# EAGLE design board (EAGLE 8.3.2)
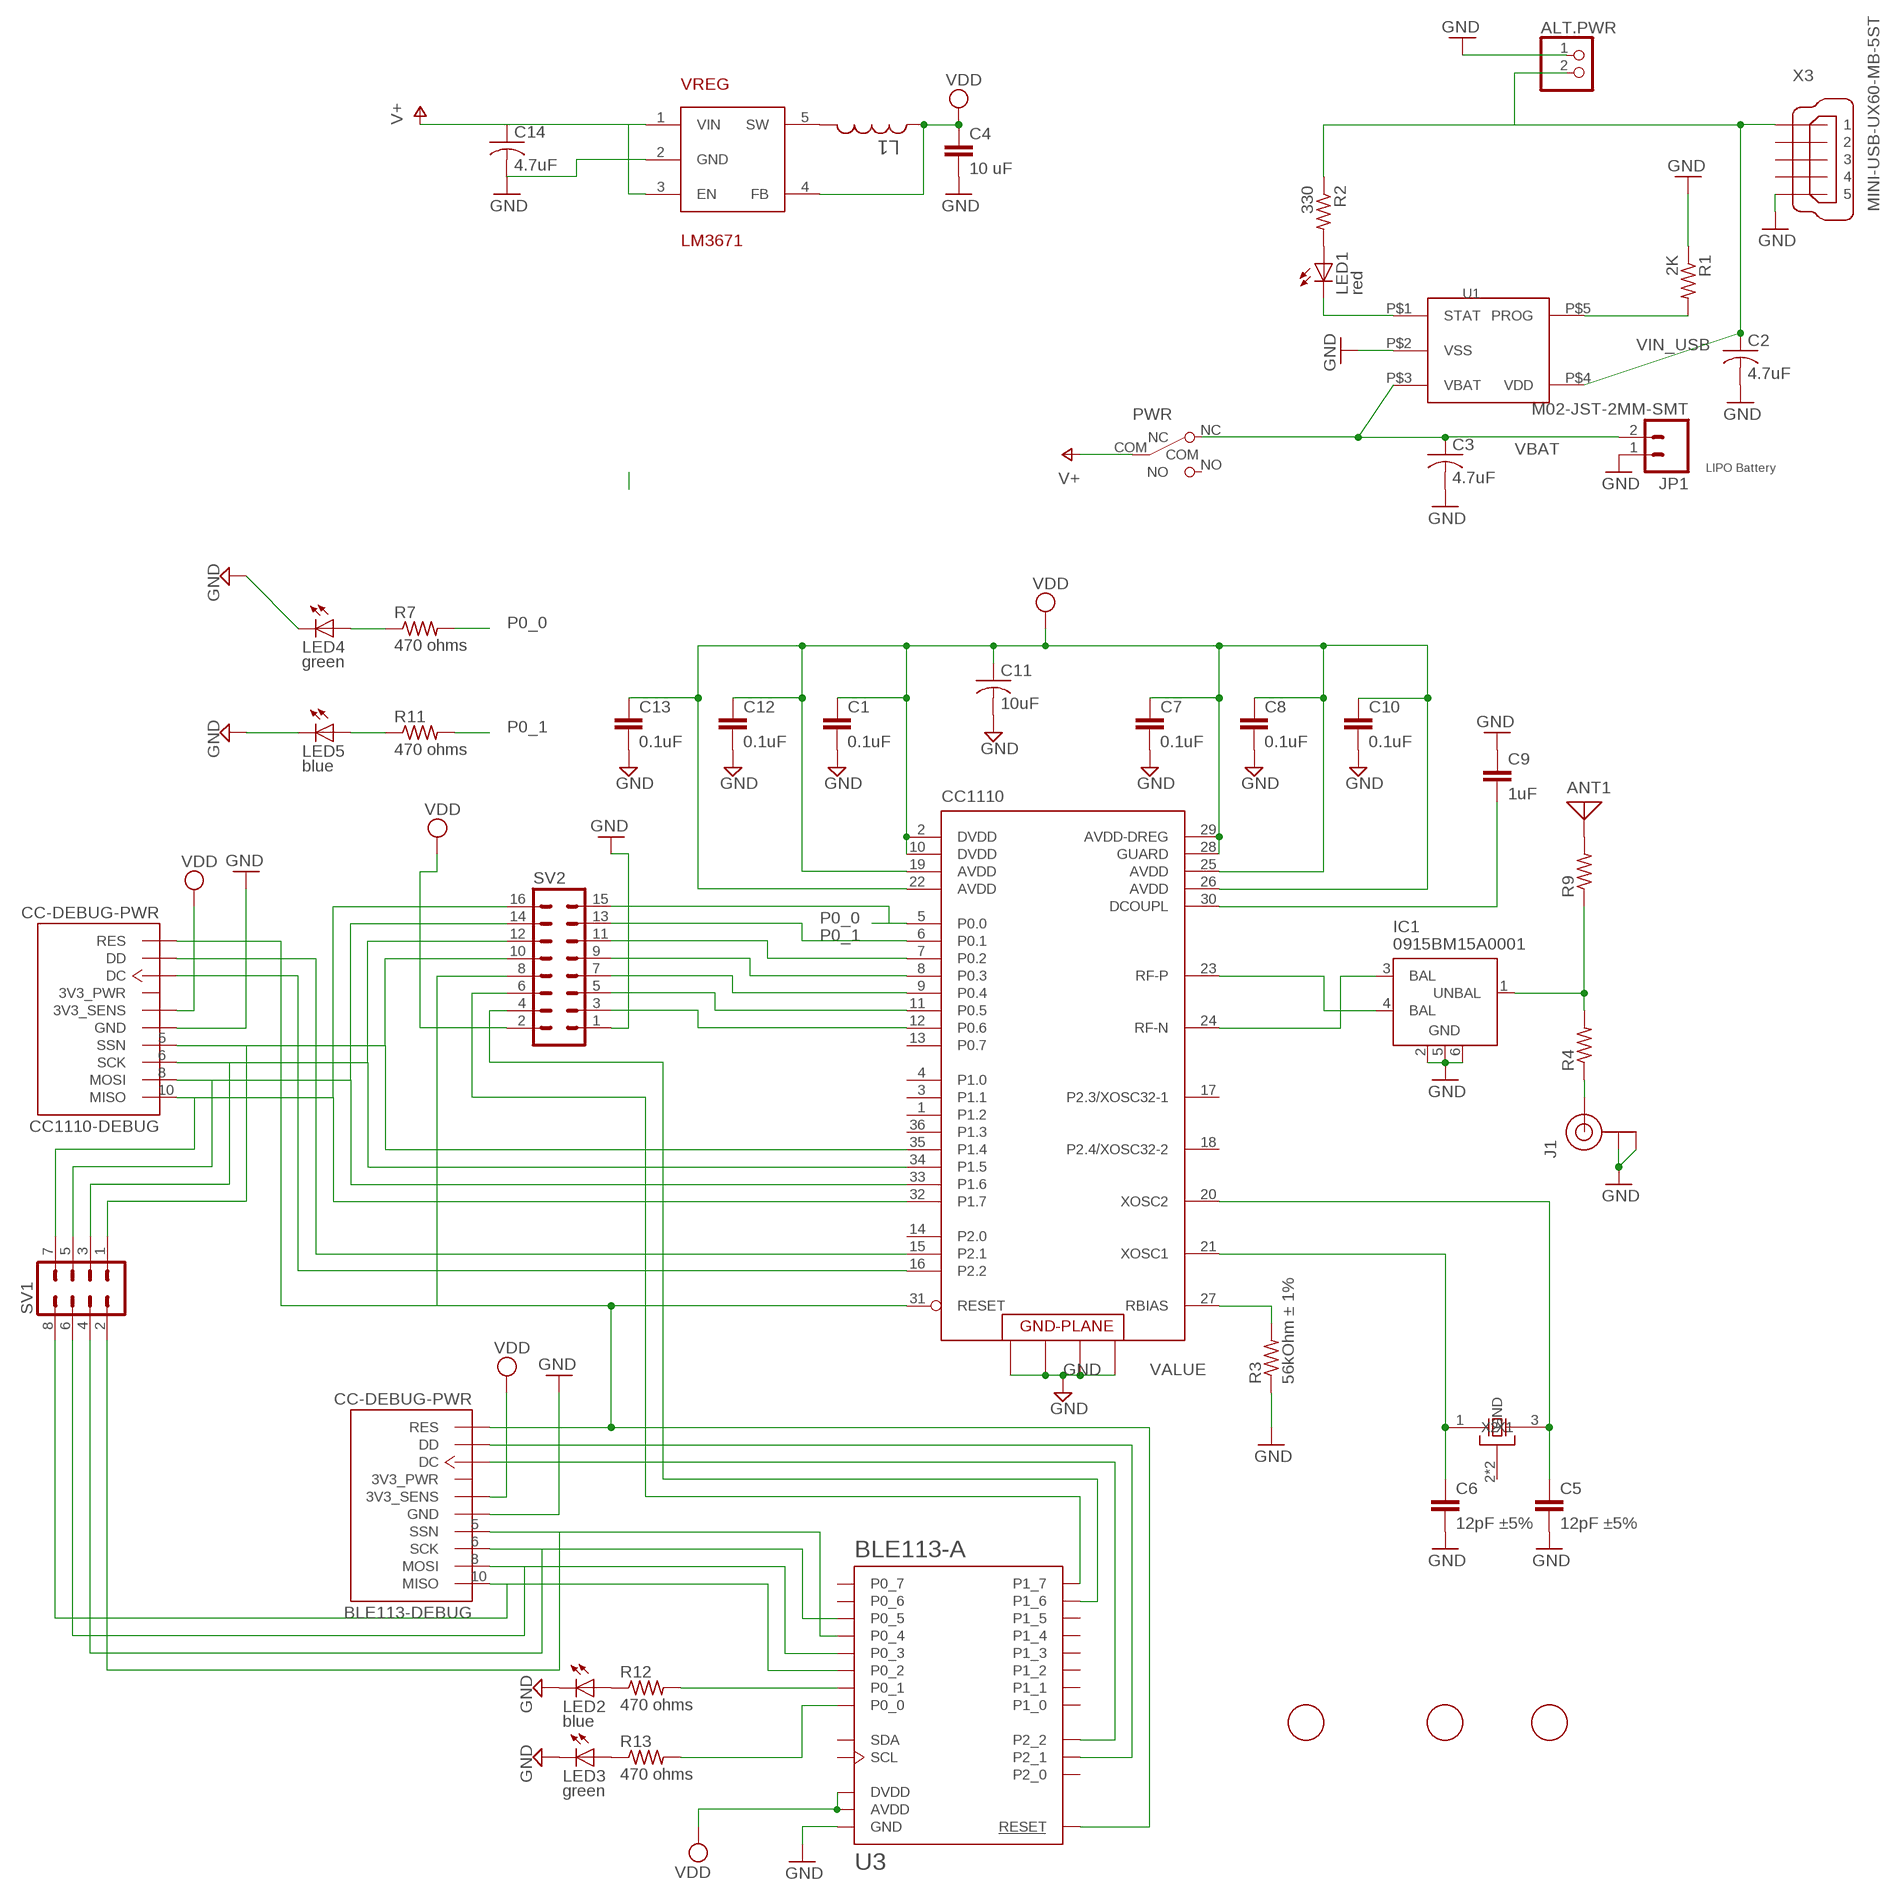
[diagram p0: schematic, sheet 1]

## Parts
ALT.PWR  PINHD-1X2  [1X02]
ANT1  ANTENNA  [PAD-01]
BLE113-DEBUG  CC-DEBUG-PWR  [CC-P05]
C1  0.1uF  C-EUC0402  [C0402]
C2  4.7uF  C-USC0603K  [C0603K]
C3  4.7uF  C-USC0603K  [C0603K]
C4  10 uF  C-EUC0805K  [C0805K]
C5  12pF ±5%  C-EUC0402K  [C0402K]
C6  12pF ±5%  C-EUC0402K  [C0402K]
C7  0.1uF  C-EUC0402  [C0402]
C8  0.1uF  C-EUC0402  [C0402]
C9  1uF  C-EUC0402K  [C0402K]
C10  0.1uF  C-EUC0402  [C0402]
C11  10uF  C-USC0805K  [C0805K]
C12  0.1uF  C-EUC0402  [C0402]
C13  0.1uF  C-EUC0402  [C0402]
C14  4.7uF  C-USC0603K  [C0603K]
CC1110  CC1110  [QLP-36_UPDATE]
CC1110-DEBUG  CC-DEBUG-PWR  [CC-P05]
FID1  FIDUCIAL  [FIDUCIAL_1MM]
FID2  FIDUCIAL  [FIDUCIAL_1MM]
FID3  FIDUCIAL  [FIDUCIAL_1MM]
IC1  0915BM15A0001  [0915BM15A0001]
J1  U.FL  [U.FL]
JP1  M02-JST-2MM-SMT  [JST-2-SMD]
L1  2.2 uH  L-USL2825P  [L2825P]
LED1  red  LEDSML0603  [SML0603]
LED2  blue  LEDSML0603  [SML0603]
LED3  green  LEDSML0603  [SML0603]
LED4  green  LEDSML0603  [SML0603]
LED5  blue  LEDSML0603  [SML0603]
PWR  SW_SLIDE  [SLIDE_SWITCH_SMD]
R1  2K  R-US_R0402  [R0402]
R2  330  R-US_R0402  [R0402]
R3  56kOhm ± 1%  R-US_R0402  [R0402]
R4  R-US_R0402  [R0402]
R7  470 ohms  R-US_R0402  [R0402]
R9  R-US_R0402  [R0402]
R11  470 ohms  R-US_R0402  [R0402]
R12  470 ohms  R-US_R0402  [R0402]
R13  470 ohms  R-US_R0402  [R0402]
SV1  MA04-2  [MA04-2]
SV2  MA08-2  [MA08-2]
U1  MCP73831  [5PIN_SOT23]
U3  BLE113-A  [BLE113-A]
VREG  LM3671  [SOT23-5]
X1  24MHz 8pF 10ppm -20C +70C  CTS_32X25_SMD  [CTS_32X25]
X3  MINI-USB-UX60-MB-5ST  [UX60-MB-5ST]

## Nets
DC: CC1110-DEBUG.3(DC) CC1110.16(P2.2)
DC_BLE: BLE113-DEBUG.3(DC) U3.P2_2
DD: CC1110-DEBUG.4(DD) CC1110.15(P2.1)
DD_BLE: BLE113-DEBUG.4(DD) U3.P2_1
GND: ALT.PWR.1 BLE113-DEBUG.1(GND) C1.2 C2.2 C3.2 C4.2 C5.2 C6.2 C7.2 C8.2 C9.1 C10.2 C11.2 C12.2 C13.2 C14.2 CC1110-DEBUG.1(GND) CC1110.37(GND) CC1110.38(GND) CC1110.39(GND) CC1110.40(GND) IC1.2(GND) IC1.5(GND) IC1.6(GND) J1.P$1(GND) J1.P$2(GND) JP1.1 LED2.C LED3.C LED4.C LED5.C R1.1 R3.1 SV2.1 U1.P$2(VSS) U3.GND U3.GND@2(GND) U3.GND@3(GND) U3.GND@4(GND) U3.GND@5(GND) U3.GND@6(GND) U3.GND@7(GND) U3.GND@8(GND) U3.GND@9(GND) U3.GND@10(GND) VREG.2(GND) X3.5
MISO: CC1110-DEBUG.10(MISO) CC1110.32(P1.7) SV1.7 SV2.16
MISO_BLE: BLE113-DEBUG.10(MISO) SV1.8 U3.P0_2
MOSI: CC1110-DEBUG.8(MOSI) CC1110.33(P1.6) SV1.5 SV2.14
MOSI_BLE: BLE113-DEBUG.8(MOSI) SV1.6 U3.P0_3
N$2: LED1.C U1.P$1(STAT)
N$3: R1.2 U1.P$5(PROG)
N$4: LED1.A R2.2
N$5: CC1110.24(RF-N) IC1.3(BAL)
N$7: CC1110.23(RF-P) IC1.4(BAL)
N$9: J1.P$3(SIGNAL) R4.1
N$10: IC1.1(UNBAL) R4.2 R9.1
N$12: ANT1.1 R9.2
N$14: CC1110.27(RBIAS) R3.2
N$16: L1.2 VREG.5(SW)
N$18: C9.2 CC1110.30(DCOUPL)
N$20: C6.1 CC1110.21(XOSC1) X1.1(X1)
N$21: C5.1 CC1110.20(XOSC2) X1.3(X2)
N$24: LED4.A R7.1
N$25: LED5.A R11.1
N$29: LED2.A R12.1
N$30: LED3.A R13.1
N$31: R12.2 U3.P0_1
N$32: R13.2 U3.P0_0
P0.2: CC1110.7(P0.2) SV2.11
P0.3: CC1110.8(P0.3) SV2.9
P0.4: CC1110.9(P0.4) SV2.7
P0.5: CC1110.11(P0.5) SV2.5
P0.6: CC1110.12(P0.6) SV2.3
P0_0: CC1110.5(P0.0) R7.2 SV2.15
P0_1: CC1110.6(P0.1) R11.2 SV2.13
P1_6_BLE: SV2.4 U3.P1_6
P1_7_BLE: SV2.6 U3.P1_7
RESET: BLE113-DEBUG.7(RES) CC1110-DEBUG.7(RES) CC1110.31(RESET) SV2.8 U3.RESET
SCK: CC1110-DEBUG.6(SCK) CC1110.34(P1.5) SV1.3 SV2.12
SCK_BLE: BLE113-DEBUG.6(SCK) SV1.4 U3.P0_5
SSN: CC1110-DEBUG.5(SSN) CC1110.35(P1.4) SV1.1 SV2.10
SSN_BLE: BLE113-DEBUG.5(SSN) SV1.2 U3.P0_4
V+: C14.1 PWR.COM VREG.1(VIN) VREG.3(EN)
VBAT: C3.1 JP1.2 PWR.NC U1.P$3(VBAT)
VDD: BLE113-DEBUG.2(3V3_SENS) C1.1 C4.1 C7.1 C8.1 C10.1 C11.1 C12.1 C13.1 CC1110-DEBUG.2(3V3_SENS) CC1110.2(DVDD) CC1110.10(DVDD) CC1110.19(AVDD) CC1110.22(AVDD) CC1110.25(AVDD) CC1110.26(AVDD) CC1110.28(GUARD) CC1110.29(AVDD-DREG) L1.1 SV2.2 U3.AVDD U3.DVDD VREG.4(FB)
VIN_USB: ALT.PWR.2 C2.1 R2.1 U1.P$4(VDD) X3.1
Unconnected: BLE113-DEBUG.9(3V3_PWR) CC1110-DEBUG.9(3V3_PWR) CC1110.1(P1.2) CC1110.3(P1.1) CC1110.4(P1.0) CC1110.13(P0.7) CC1110.14(P2.0) CC1110.17(P2.3/XOSC32-1) CC1110.18(P2.4/XOSC32-2) CC1110.36(P1.3) PWR.NO U3.P0_6 U3.P0_7 U3.P1_0 U3.P1_1 U3.P1_2 U3.P1_3 U3.P1_4 U3.P1_5 U3.P2_0 U3.SCL U3.SDA X3.2 X3.3 X3.4

## Notes on the sheet
- LIPO Battery

## Power pins joined to a net without a drawn wire
GND: X1.2(GND) X1.4(GND)

## Library data of the parts
ALT.PWR = pinhead:PINHD-1X2: PIN HEADER
ANT1 = discrete:ANTENNA: Antenna
BLE113-DEBUG CC1110-DEBUG = parts:CC-DEBUG-PWR: CC debugger connection with various form factors. 2x5-pin 0.05" pitch header include Pin 9 (VDD) supply connection as separate pin. https://github.com/jrowberg/sf-oshw Last updated 2014-01-04 by Jeff Rowberg <jeff@rowberg.net>
C1 C4-C10 C12 C13 = rcl:C-EU: CAPACITOR
C2 C3 C11 C14 = rcl:C-US: CAPACITOR, American symbol
CC1110 = board:CC1110: True System-on-Chip with Low Power RF Transceiver and 8051 MCU
FID1-FID3 = adafruit:FIDUCIAL: For use by pick and place machines to calibrate the vision/machine, 1mm By microbuilder.eu
IC1 = parts:0915BM15A0001: 915 MHz Impedance Matched Balun-Filter For TI CC11xx Chipset family Data sheet <http://www.johansontechnology.com/datasheets/chipset-specific/0915BM15A0001.pdf>
J1 = SparkFun-Connectors:U.FL: SMD antenna connector- WRL-09144; PROD_ID: CONN-09193
JP1 = SparkFun-Connectors:M02: Standard 2-pin 0.1" header. Use with - straight break away headers ( PRT-00116) - right angle break away headers (PRT-00553) - swiss pins (PRT-00743) - machine pins (PRT-00117) - female headers (PRT-00115) Molex polarized connector foot print use with: PRT-08233 with associated crimp pins and housings. 2.54_SCREWTERM for use with PRT-10571. 3.5mm Screw Terminal footprints for PRT-08084 5mm Screw Terminal footprints for use with PRT-08432; PROD_ID: CONN-08352
L1 = rcl:L-US: INDUCTOR, American symbol
LED1-LED5 = led:LED: LED OSRAM: - CHIPLED LG R971, LG N971, LY N971, LG Q971, LY Q971, LO R971, LY R971 LH N974, LH R974 LS Q976, LO Q976, LY Q976 LO Q996 - Hyper CHIPLED LW Q18S LB Q993, LB Q99A, LB R99A - SideLED LS A670, LO A670, LY A670, LG A670, LP A670 LB A673, LV A673, LT A673, LW A673 LH A674 LY A675 LS A676, LA A676, LO A676, LY A676, LW A676 LS A679, LY A679, LG A679 - Hyper Micro SIDELED® LS Y876, LA Y876, LO Y876, LY Y876 LT Y87S - SmartLED LW L88C, LW L88S LB L89C, LB L89S, LG L890 LS L89K, LO L89K, LY L89K LS L896, LA L896, LO L896, LY L896 - TOPLED LS T670, LO T670, LY T670, LG T670, LP T670 LSG T670, LSP T670, LSY T670, LOP T670, LYG T670 LG T671, LOG T671, LSG T671 LB T673, LV T673, LT T673, LW T673 LH T674 LS T676, LA T676, LO T676, LY T676, LB T676, LH T676, LSB T676, LW T676 LB T67C, LV T67C, LT T67C, LS T67K, LO T67K, LY T67K, LW E67C LS E67B, LA E67B, LO E67B, LY E67B, LB E67C, LV E67C, LT E67C LW T67C LS T679, LY T679, LG T679 LS T770, LO T770, LY T770, LG T770, LP T770 LB T773, LV T773, LT T773, LW T773 LH T774 LS E675, LA E675, LY E675, LS T675 LS T776, LA T776, LO T776, LY T776, LB T776 LHGB T686 LT T68C, LB T68C - Hyper Mini TOPLED® LB M676 - Mini TOPLED Santana® LG M470 LS M47K, LO M47K, LY M47K Source: http://www.osram.convergy.de LUXEON: - LUMILED® LXK2-PW12-R00, LXK2-PW12-S00, LXK2-PW14-U00, LXK2-PW14-V00 LXK2-PM12-R00, LXK2-PM12-S00, LXK2-PM14-U00 LXK2-PE12-Q00, LXK2-PE12-R00, LXK2-PE12-S00, LXK2-PE14-T00, LXK2-PE14-U00 LXK2-PB12-K00, LXK2-PB12-L00, LXK2-PB12-M00, LXK2-PB14-N00, LXK2-PB14-P00, LXK2-PB14-Q00 LXK2-PR12-L00, LXK2-PR12-M00, LXK2-PR14-Q00, LXK2-PR14-R00 LXK2-PD12-Q00, LXK2-PD12-R00, LXK2-PD12-S00 LXK2-PH12-R00, LXK2-PH12-S00 LXK2-PL12-P00, LXK2-PL12-Q00, LXK2-PL12-R00 Source: www.luxeon.com KINGBRIGHT: KA-3528ASYC Source: www.kingbright.com
PWR = parts:SW_SLIDE
R1-R4 R7 R9 R11-R13 = rcl:R-US_: RESISTOR
SV1 = con-lstb:MA04-2: PIN HEADER; OC_FARNELL: unknown; OC_NEWARK: unknown
SV2 = con-lstb:MA08-2: PIN HEADER; OC_FARNELL: unknown; OC_NEWARK: unknown
U1 = parts:MCP73831: Digikey No:- __MCP73831T-2ACI/OTCT-ND__
U3 = sf-bluegiga:BLE113: Bluetooth Low Energy single-mode module - Bluetooth 4.0 (CC2541). BLE113-A variant has an on-module ceramic chip antenna. BLE113-A variant includes keepout/restrict area. Antenna edge of the module should be flush up against the edge of the PCB. See datasheet for variant layout details. The BLE113 is a Bluetooth Smart module targeted for small and low-power sensors and accessories. It integrates all features required for a Bluetooth Smart application, including Bluetooth radio, software stack, and GATT-based profiles. The BLE113 Bluetooth Smart module can also host end-user applications, which means no external micro controller is required in size or price constrained devices. Moreover, it has flexible hardware interfaces to connect to different peripherals and sensors and can be powered directly from a standard 3V coin cell battery or a pair of AAA batteries. In the lowest power sleep mode it merely consumes 500 nA and will wake up within a few hundred microseconds. The BLE113 Bluetooth Smart module conusmer approximately 30% less power and is smaller than the BLE112 Bluetooth Smart Module. http://www.bluegiga.com/en-US/products/bluetooth-4.0-modules/ble113-bluetooth--smart-module https://github.com/jrowberg/sf-oshw Last updated 2014-01-04 by Jeff Rowberg <jeff@rowberg.net>; ANTENNA: On-module ceramic chip antenna
VREG = texas-custom:LM3671: Texas Instruments LM3671, LM3671Q 2MHz, 600mA Step-Down DC-DC Converter
X1 = cts_crystal:CTS_32X25_SMD
X3 = con-hirose:MINI-USB-: MINI USB Connector Source: http://www.hirose.co.jp/cataloge_hp/e24000019.pdf; OC_FARNELL: unknown; OC_NEWARK: unknown

## Board
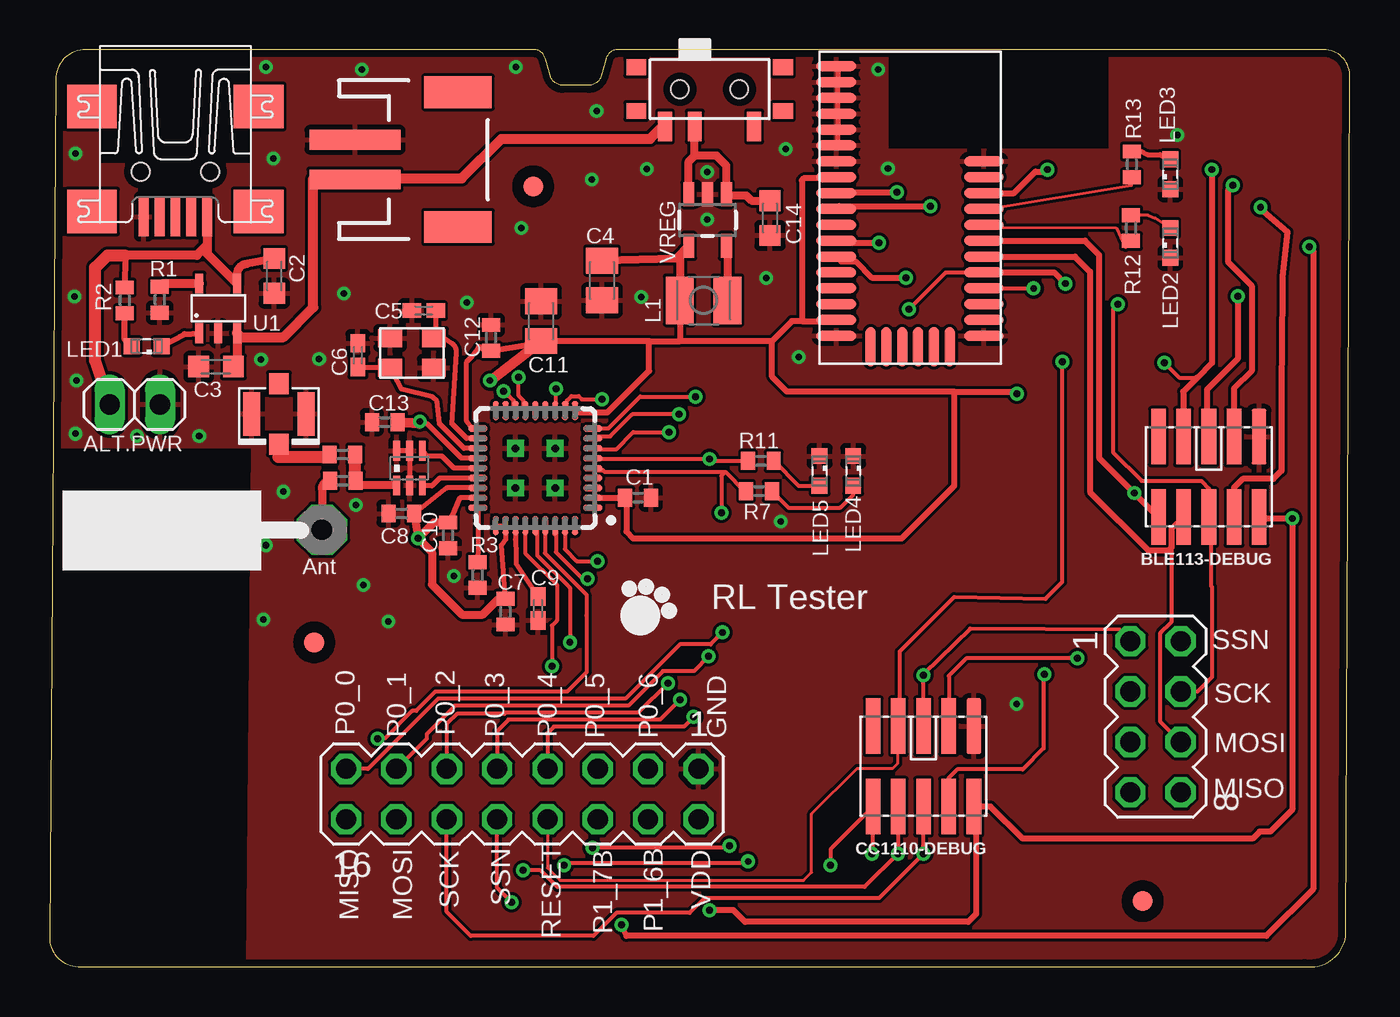
[diagram p1: board, top side]
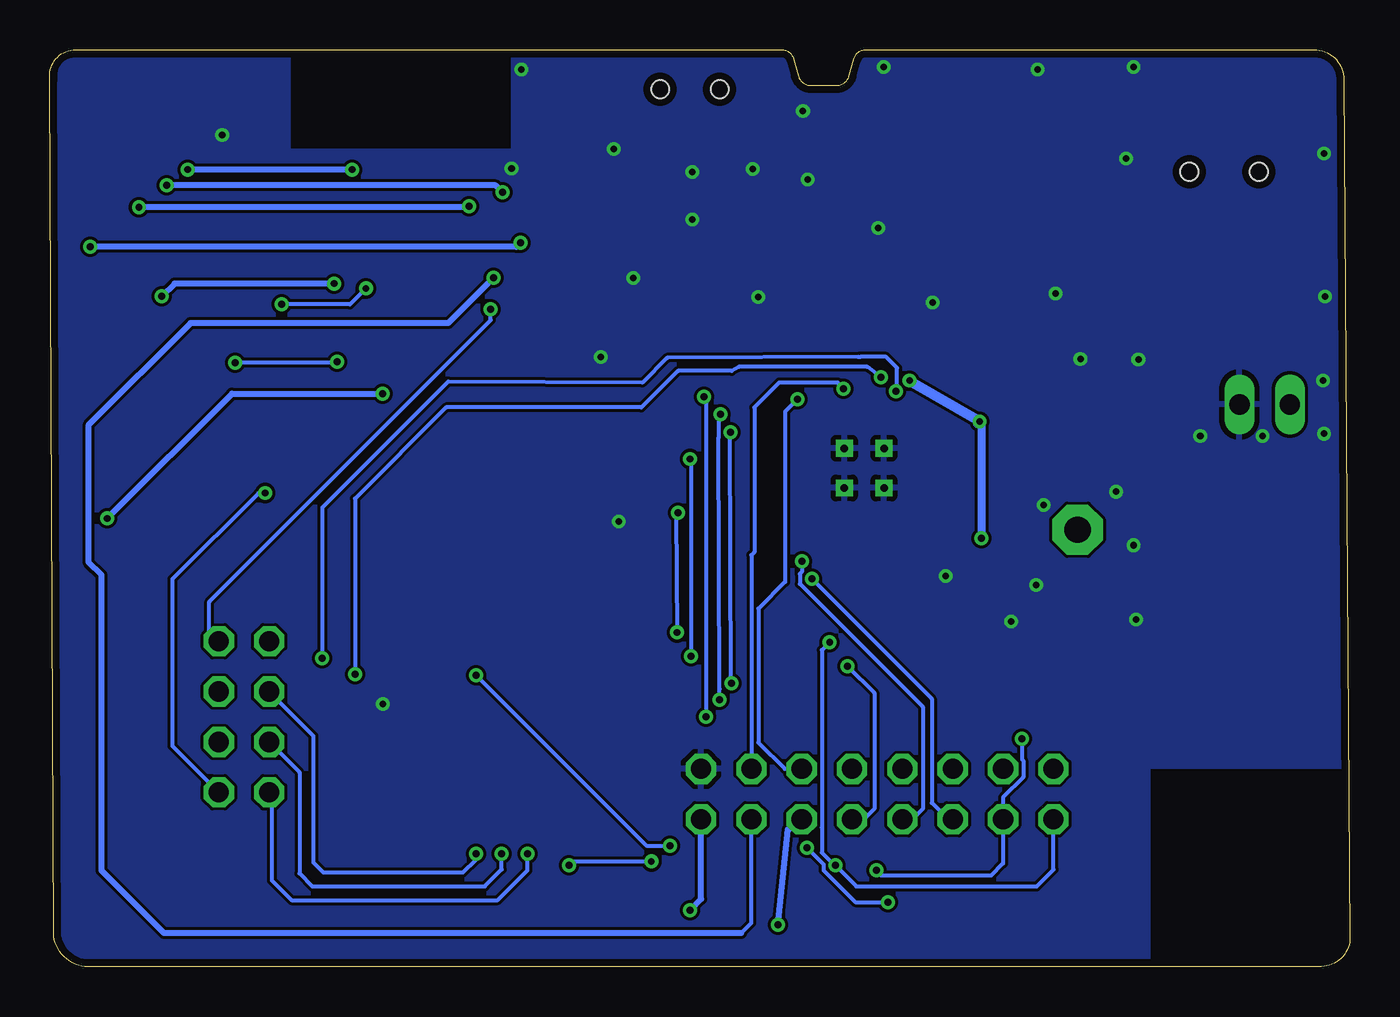
[diagram p2: board, bottom side, seen from below]

Size 65.61 x 46.27 mm. Coordinates in mm from the lower left corner, seen from the top.
Outline: 0.3,44.75 0,1.39 arc90 1.57,0.02 63.33,0.02 arc90 65.4,1.54 65.6,44.75 arc90 64.43,46.27 28.68,46.27 arc74 28.07,45.8 27.83,44.93 arc-74 27.22,44.47 25.88,44.47 arc-74 25.27,44.93 25.03,45.8 arc74 24.42,46.27 1.82,46.27 arc90 0.3,44.75
Copper layers (1*16): Top 0.0356mm / dielectric 1.5011mm / Bottom 0.0356mm
Design rules "oshpark *": minimum track width 6mil, minimum drill 13mil, track to track 6mil, track to pad 6mil, pad to pad 6mil, via to via 6mil, smd to smd 6mil, copper to edge 15mil, drill to drill 6mil, minimum pad ring 7mil, minimum via ring 7mil, stop-mask expansion 3mil, vias tented up to drill 21mil, thermal gap 10mil
bRestrict: area 0.1,0 to 10.1,10

### Footprints (pad centres in the part's own frame; a part is rotated, then mirrored left to right if it is on the bottom)
1X02 = drill 1.016 long: 1 -1.27,0; 2 1.27,0
PAD-01 = drill 1.321 pad 2.54 octagon: 1 0,0
CC-P05 = smd 0.74 x 2.8: 1 -2.54,-2.03; 2 -2.54,2.03; 3 -1.27,-2.03; 4 -1.27,2.03; 5 0,-2.03; 6 0,2.03; 7 1.27,-2.03; 8 1.27,2.03; 9 2.54,-2.03; 10 2.54,2.03
C0402 = smd 0.7 x 0.9: 1 -0.65,0; 2 0.65,0
C0603K = smd 1.05 x 1.08: 1 -0.875,0; 2 0.875,0
C0805K = smd 1.3 x 1.6: 1 -1,0; 2 1,0
C0402K = smd 0.925 x 0.74: 1 -0.6,0; 2 0.6,0
QLP-36_UPDATE = smd 0.95 x 0.3: 1 -2.9,2; 2 -2.9,1.5; 3 -2.9,1; 4 -2.9,0.5; 5 -2.9,0; 6 -2.9,-0.5; 7 -2.9,-1; 8 -2.9,-1.5; 9 -2.9,-2; 19 2.9,-2; 20 2.9,-1.5; 21 2.9,-1; 22 2.9,-0.5; 23 2.9,0; 24 2.9,0.5; 25 2.9,1; 26 2.9,1.5; 27 2.9,2 | smd 0.3 x 0.95: 10 -2,-2.9; 11 -1.5,-2.9; 12 -1,-2.9; 13 -0.5,-2.9; 14 0,-2.9; 15 0.5,-2.9; 16 1,-2.9; 17 1.5,-2.9; 18 2,-2.9; 28 2,2.9; 29 1.5,2.9; 30 1,2.9; 31 0.5,2.9; 32 0,2.9; 33 -0.5,2.9; 34 -1,2.9; 35 -1.5,2.9; 36 -2,2.9 | drill 0.381 pad 0.85 square: 37 -1,1; 38 1,1; 39 -1,-1; 40 1,-1
FIDUCIAL_1MM = smd 1 x 1: 1 0,0
0915BM15A0001 = smd 0.35 x 1: 1 -0.65,-0.875; 2 0,-0.875; 3 0.65,-0.875; 4 0.65,0.875; 5 0,0.875; 6 -0.65,0.875
U.FL = smd 2.2 x 0.85: P$1 0,1.375; P$2 0,-1.375 | smd 1.05 x 1: P$3 1.525,0; P$4 -1.525,0
JST-2-SMD = smd 1 x 4.6: 1 -1,-3.7; 2 1,-3.7 | smd 1.6 x 3.4: NC1 -3.4,1.5; NC2 3.4,1.5
L2825P = smd 1.4 x 2.4: 1 -1.2,0; 2 1.2,0
SML0603 = smd 0.8 x 0.8: A 0.75,0; C -0.75,0
SLIDE_SWITCH_SMD = smd 0.7 x 1.5: COM 0.75,1.875; NC 2.25,1.875; NO -2.25,1.875 | smd 1 x 0.8: P$1 -3.7,-1.1; P$2 -3.7,1.1; P$3 3.7,1.1; P$4 3.7,-1.1 | hole 0.9: -1.5,0; 1.5,0
R0402 = smd 0.7 x 0.9: 1 -0.65,0; 2 0.65,0
MA04-2 = drill 1.016 octagon: 1 -3.81,-1.27; 2 -3.81,1.27; 3 -1.27,-1.27; 4 -1.27,1.27; 5 1.27,-1.27; 6 1.27,1.27; 7 3.81,-1.27; 8 3.81,1.27
MA08-2 = drill 1.016 octagon: 1 -8.89,-1.27; 2 -8.89,1.27; 3 -6.35,-1.27; 4 -6.35,1.27; 5 -3.81,-1.27; 6 -3.81,1.27; 7 -1.27,-1.27; 8 -1.27,1.27; 9 1.27,-1.27; 10 1.27,1.27; 11 3.81,-1.27; 12 3.81,1.27; 13 6.35,-1.27; 14 6.35,1.27; 15 8.89,-1.27; 16 8.89,1.27
5PIN_SOT23 = smd 0.4 x 1: P$1 0.4,-0.63; P$2 1.35,-0.63; P$3 2.3,-0.63; P$4 2.3,1.87; P$5 0.4,1.87
BLE113-A = smd 2 x 0.5: AVDD -3.725,1.538; DVDD -3.725,-5.662; GND -3.725,7.138; GND@2 -3.725,6.338; GND@3 -3.725,5.537; GND@4 -3.725,4.737; GND@5 -3.725,3.938; GND@6 -3.725,3.138; GND@7 -3.725,2.337; GND@8 -3.725,-6.463; GND@9 3.725,-6.463; GND@10 3.725,2.337; NC -3.725,-4.862; NC@2 3.725,1.538; P0_0 3.725,-0.062; P0_1 3.725,-0.863; P0_2 3.725,-1.663; P0_3 3.725,-2.462; P0_4 3.725,-3.263; P0_5 3.725,-4.062; P0_6 3.725,-4.862; P0_7 3.725,-5.662; P1_6 -3.725,-2.462; P1_7 -3.725,-1.663; P2_0 -3.725,-0.863; P2_1 -3.725,-0.062; P2_2 -3.725,0.738; RESET 3.725,0.738; SCL -3.725,-3.263; SDA -3.725,-4.062 | smd 0.5 x 2: P1_0 2,-7.013; P1_1 1.2,-7.013; P1_2 0.4,-7.013; P1_3 -0.4,-7.013; P1_4 -1.2,-7.013; P1_5 -2,-7.013
SOT23-5 = smd 0.55 x 1.2: 1 -0.95,-1.3; 2 0,-1.3; 3 0.95,-1.3; 4 0.95,1.3; 5 -0.95,1.3
CTS_32X25 = smd 1.2 x 0.9: 1 -1.1,-0.7; 2 1.1,-0.7; 3 1.1,0.8; 4 -1.1,0.8
UX60-MB-5ST = smd 2 x 0.5: 1 2.25,1.6; 2 2.25,0.8; 3 2.25,0; 4 2.25,-0.8; 5 2.25,-1.6 | smd 2.2 x 2.5: M1 -3.3,-4.2; M2 -3.3,4.2; M3 2,4.2; M4 2,-4.2 | hole 0.9: 0,-1.75; 0,1.75

### Placement (x,y rotation side)
ALT.PWR  4.3,28.37 180 top
ANT1  13.75,22.05 0 top
BLE113-DEBUG  58.49,24.72 180 top
C1  29.69,23.67 0 top
C2  11.34,34.85 270 top
C3  8.4,30.27 180 top
C4  27.88,34.62 270 top
C5  18.89,33.1 180 top
C6  15.56,30.85 90 top
C7  23,17.92 270 top
C8  17.75,22.87 180 top
C9  24.64,18.08 90 top
C10  20.1,21.77 270 top
C11  24.8,32.57 90 top
C12  22.27,31.73 90 top
C13  16.92,27.48 180 top
C14  36.35,37.77 270 top
CC1110  24.51,25.16 180 top
CC1110-DEBUG  44.09,10.12 180 top
FID1  13.35,16.37 0 top
FID2  24.4,39.37 0 top
FID3  55.15,3.32 0 top
IC1  18.16,25.16 0 top
J1  11.58,27.89 270 top
JP1  19.11,40.72 270 top
L1  33,33.62 0 top
LED1  4.9,31.31 180 top
LED2  56.55,36.52 90 top
LED3  56.55,39.98 90 top
LED4  40.55,25.02 270 top
LED5  38.85,25.02 270 top
PWR  33.3,44.27 180 top
R1  5.56,33.65 90 top
R2  3.79,33.62 270 top
R3  21.6,19.77 90 top
R4  14.78,25.84 0 top
R7  35.79,24 180 top
R9  14.8,24.52 180 top
R11  35.89,25.52 180 top
R12  54.56,37.27 270 top
R13  54.6,40.48 270 top
SV1  55.8,12.62 270 top
SV2  23.85,8.72 180 top
U1  7.16,32.6 0 top
U3  43.42,38.29 0 top
VREG  33.2,37.67 180 top
X1  18.29,30.91 0 top
X3  6.35,40.1 270 top

### Tracks (layer width: path | path; a pad name or v marks a point on that pad's centre or on a via)
DC  (via drill 0.35)
  Top 0.2: CC1110.16 23.41,28.16 23.41,28.57 23.19,28.79 23.15,28.79 v22.9,29.04 | v51.85,15.57 46.25,15.57 45.36,14.68 CC1110-DEBUG.3
  Bottom 0.2: v51.85,15.57 51.85,23.17 45.5,29.52 35.7,29.47 34.45,30.72 24.8,30.77 24.7,30.77 23.4,30.77 22.85,30.22 22.85,29.09 v22.9,29.04
DC_BLE  (via drill 0.35)
  Top 0.3: U3.P2_2 39.73,39.07 v42.75,39.07 | v59.7,39.42 59.45,39.17 59.45,35.57 60.65,34.37 60.65,30.07 59.76,29.18 BLE113-DEBUG.3
  Bottom 0.3: v42.75,39.07 43.1,39.42 v59.7,39.42
DD  (via drill 0.35)
  Top 0.2: CC1110.15 24.05,28.1 23.91,28.24 23.91,28.57 23.67,28.81 v23.67,29.73 | v50.2,14.77 50.15,14.72 50.15,11.02 49.1,9.97 45.8,9.97 45.36,9.53 CC1110-DEBUG.4
  Bottom 0.2: v50.2,14.77 50.2,23.62 45.6,28.22 35.75,28.22 33.9,30.07 31.2,30.07 30.85,30.27 24.35,30.27 v23.67,29.73
DD_BLE  (via drill 0.35)
  Top 0.3: U3.P2_1 39.83,38.37 v44.45,38.37 | v61.1,38.32 61.05,38.27 62.45,37.07 62.2,34.82 62.2,34.02 62.15,29.12 62.15,25.02 61.75,24.62 60.2,24.62 59.76,24.18 BLE113-DEBUG.4
  Bottom 0.3: v44.45,38.37 44.5,38.32 v61.1,38.32
GND  (via drill 0.33, 0.33 pad 0.41)
  Top 0.152: 39.77,44.77 U3.GND@2 39.77,44.62 | 39.77,45.38 U3.GND | 39.77,42.33 U3.GND@5 39.77,42.18 | 39.77,42.94 U3.GND@4 39.77,43.09 | 39.77,43.7 U3.GND@3 39.77,43.85 | 39.77,41.57 U3.GND@6
  Top 0.24: 39.77,45.38 39.77,44.77 | 39.77,42.94 39.77,42.33 | 39.77,43.09 39.77,43.7 | 39.77,43.85 39.77,44.62 | 39.77,41.57 39.77,42.18
  Top 0.26: C10.2 20.3,21.27 | IC1.2 IC1.5 IC1.6
  other vias: 11.8,23.97 11.3,40.77 27.6,43.17 27.35,39.72 56.9,41.97 23.8,37.27 21.05,33.52 10.68,30.64 14.85,33.97 10.93,21.27 15.45,23.29 17.1,17.42 13.6,30.67 41.8,45.27 42.3,40.27 48.8,13.27 20.4,19.72 36.9,22.47 37.8,30.77 36.15,34.74 1.3,26.89 7.55,26.77 1.25,33.82 1.3,41.02 30.12,40.24 23.53,45.39 15.75,45.27 10.93,45.39 10.8,17.52 15.83,19.27 29.85,33.79 37.15,41.24 4.4,26.77 1.35,29.57 33.17,40.09 33.17,37.69
  pour Bottom: 0.3,46.27 65.6,46.27 65.45,0.17 0.05,0.02
  pour Top (rank 2): 10.05,0.02 10.3,26.27 0.3,26.27 0.3,46.27 65.6,46.27 65.5,0.22
  pour Top (no thermals): 32.95,39.57 32.6,39.82 32.6,39.97 33.8,39.92 33.5,39.57
  pour Top (no thermals): 32.95,38.37 32.65,38.22 32.9,37.97 33.65,38.02 33.75,38.22 33.45,38.37
MISO  (via drill 0.35)
  Top 0.2: v41.5,5.72 41.55,5.77 CC1110-DEBUG.10 39.4,5.93 v39.4,5.12 | CC1110.32 24.61,22.16 24.61,20.76 26.25,19.12 v26.25,16.37 | v25.95,5.12 25.95,5.22 35.15,5.22 v35.25,5.32
  Bottom 0.2: SV1.7 54.4,8.68 54.4,4.37 53.4,3.37 43,3.37 41.5,4.87 v41.5,5.72 | SV2.16 14.96,4.91 15.8,4.07 24.9,4.07 v25.95,5.12 26,5.12 26.65,5.77 26.65,7.02 26.65,7.03 26.65,15.97 v26.25,16.37 | v39.4,5.12 39.2,5.32 v35.25,5.32
MISO_BLE  (via drill 0.35)
  Top 0.3: U3.P0_2 52.24,36.63 52.95,35.92 52.95,25.69 v54.73,23.9 BLE113-DEBUG.10
  Bottom 0.2: SV1.8 59.4,11.14 59.4,19.57 55.06,23.9 v54.73,23.9
MOSI  (via drill 0.35)
  Top 0.2: CC1110-DEBUG.8 42.82,5.74 v42.8,5.72 41.12,4.04 25.61,4.04 24.79,4.87 v23.9,4.87 | CC1110.33 25,20.87 27.09,18.78 27.09,17.72 27.1,17.71 27.1,14.87 26.11,13.88 19.46,13.88 18.5,12.92 18.3,12.92 16.9,11.52 v16.55,11.52
  Bottom 0.2: SV1.5 53,9.82 53,4.72 52.35,4.07 43.65,4.07 42.8,4.92 v42.8,5.72 | v16.55,11.52 16.55,10.47 16.49,10.41 16.49,9.57 17.5,8.55 SV2.14 17.5,5.22 18.1,4.62 23.65,4.62 v23.9,4.87
MOSI_BLE
  Top 0.2: 56.62,21.16 56.62,17.42 56.06,16.85 56.06,12.36 SV1.6
  Top 0.3: U3.P0_3 51.74,35.83 52.5,35.07 52.5,23.94 55.45,20.99 56.45,20.99 56.62,21.16 56.62,22.09 BLE113-DEBUG.8
N$2
  Top 0.3: LED1.C 6.81,31.92 U1.P$1
N$3
  Top 0.45: U1.P$5 5.73,34.47 R1.2
N$4
  Top 0.3: LED1.A 3.79,31.67 R2.2
N$5
  Top 0.26: CC1110.24 19.69,24.66 19.3,24.27 18.82,24.27 IC1.3
N$7
  Top 0.26: CC1110.23 20.41,25.16 19.8,25.77 19.07,25.77 IC1.4
N$9
  Top 0.6: R4.1 14,25.72 11.55,25.72 11.58,25.74 J1.P$3
N$10
  Top 0: R9.1 15.43,24.54
  Top 0.24: 17.55,24.24 IC1.1 17.5,24.27
  Top 0.406: IC1.1 15.69,24.28 arc-90 R9.1
  Top 0.6: 15.43,24.54 R4.2
N$12
  Top 0.406: R9.2 arc90 13.75,24.11 ANT1.1
N$14
  Top 0.26: CC1110.27 21.61,21.27 R3.2
N$16
  Top 0.406: VREG.5 34.2,36.32 L1.2
N$18
  Top 0.26: CC1110.30 23.51,21.56 23.55,20.77 23.55,20.33 C9.2
N$20
  Top 0.24: CC1110.21 20.91,26.16 19.68,27.39 19.55,28.52 19.3,28.77 17.75,29.14 X1.1 17.14,30.25 C6.1
N$21
  Top 0.24: CC1110.20 21.04,26.66 20.3,27.39 20.53,30.99 arc58 20.32,31.43 19.68,31.89 19.3,31.89 19.38,31.81 19.48,31.81 | C5.1 19.48,31.81 | 19.48,31.81 X1.3
N$24
  Top 0.2: R7.1 37.27,23.17 39.9,23.17 40.55,23.82 LED4.A
N$25
  Top 0.2: R11.1 37.79,24.27 LED5.A
N$29
  Top 0.152: LED2.A 55.8,37.77 55.44,37.91 R12.1
N$30
  Top 0.24: R13.1 55.06,41.13 55.4,40.97 56.04,40.97 LED3.A
N$31
  Top 0.152: R12.2 54.29,36.28 53.82,37.28 48,37.3 47.24,37.3 U3.P0_1
N$32
  Top 0.152: R13.2 54.58,39.42 47.24,38.22 U3.P0_0
P0.2  (via drill 0.35)
  Top 0.2: 27.43,26.18 CC1110.7 27.45,26.12 28.6,26.12 29.45,26.97 v31.25,26.97 31.3,26.97 | 31.25,14.37 v31.2,14.32 29.7,12.82 23.01,12.82 22.95,12.77 20.55,12.77 20.04,12.26 SV2.11
  Bottom 0.2: v31.25,26.97 31.3,26.92 31.25,14.32 | 31.25,14.32 | 31.25,14.32 v31.2,14.32
P0.3  (via drill 0.35)
  Top 0.2: CC1110.8 27.51,26.76 28.29,26.76 29.4,27.87 v31.75,27.87 31.85,27.87 | v31.8,13.47 30.8,12.47 25.3,12.47 23.15,12.47 22.58,11.9 SV2.9
  Bottom 0.2: v31.75,27.87 31.86,27.76 31.86,26.72 31.85,26.71 31.8,14.02 v31.8,13.47
P0.4  (via drill 0.35)
  Top 0.2: CC1110.9 28.2,27.17 29.8,28.77 v32.6,28.77 | v32.5,12.62 32,12.12 25.45,12.12 25.12,11.79 SV2.7
  Bottom 0.2: v32.6,28.77 32.5,28.67 v32.5,12.62
P0.5  (via drill 0.35)
  Top 0.2: CC1110.11 26.11,28.16 26.11,28.57 26.33,28.79 26.69,28.79 26.86,28.62 v27.88,28.62
  Bottom 0.2: v27.88,28.62 28.5,28 28.5,19.42 29.85,18.07 29.85,11.32 28.52,9.99 SV2.5
P0.6  (via drill 0.35)
  Top 0.2: CC1110.12 25.55,28.1 v25.55,29.17
  Bottom 0.2: v25.55,29.17 25.85,29.47 28.8,29.47 30.05,28.22 30.05,20.92 30.2,20.77 SV2.3
P0_0  (via drill 0.35)
  Top 0.2: CC1110.5 27.51,25.06 27.92,25.06 28.01,24.97 34.1,24.97 | 34.1,24.97 35.07,24 R7.2 | 34.1,24.97 33.9,24.77 v33.9,22.92 | v33.95,16.87 33.35,16.27 31.8,16.27 29.05,13.53 19.61,13.53 16.07,9.99 SV2.15
  Bottom 0.2: v33.9,22.92 34,22.82 v33.95,16.87
P0_1  (via drill 0.35)
  Top 0.2: v33.25,15.67 32.5,14.92 30.95,14.92 29.2,13.18 20.46,13.18 19.03,11.74 19.03,11.52 SV2.13 | 27.5,25.57 CC1110.6 27.45,25.62 v33.3,25.62 33.39,25.52 R11.2
  Bottom 0.2: v33.3,25.62 33.25,25.57 v33.25,15.67
P1_6_BLE  (via drill 0.35)
  Top 0.3: U3.P1_6 39.94,35.58 40.67,35.58 41.49,34.77 v43.2,34.77
  Bottom 0.2: 30.7,1.72 30.2,2.22 SV2.4
  Bottom 0.3: v43.2,34.77 45.5,32.47 58.5,32.47 63.65,27.32 63.65,20.42 63,19.77 63,4.87 59.85,1.72 30.7,1.72
P1_7_BLE  (via drill 0.35)
  Top 0.3: U3.P1_7 39.81,36.52 v41.85,36.52 | v63.55,36.32 63.75,36.12 63.75,3.92 61.4,1.57 29.1,1.57 28.85,2.07 v28.85,2.12
  Bottom 0.3: v41.85,36.52 42.05,36.32 v63.55,36.32 | v28.85,2.12 28.36,6.93 SV2.6
RESET  (via drill 0.35)
  Top 0.152: SV2.8 25.12,5 25.75,4.37 38.05,4.37 38.45,4.77 38.45,7.72 40.75,10.02 42.55,10.02 42.8,10.27 42.8,12.12 CC1110-DEBUG.7
  Top 0.2: CC1110-DEBUG.7 42.9,12.22 42.9,15.92 45.65,18.67 50.25,18.57 51.1,19.42 v51.1,30.52 | v56.25,30.47 57,29.72 57.9,29.72 | CC1110.31 24,20.87 25.6,19.27 25.6,17.47 25.35,17.22 v25.35,15.17
  Top 0.3: U3.RESET 48.66,39.03 49.75,40.12 50.25,40.12 v50.35,40.22 | v58.65,40.22 58.65,30.47 57.9,29.72 57.2,29.02 57.2,26.77 BLE113-DEBUG.7
  Bottom 0.2: v51.1,30.52 51.15,30.47 v56.25,30.47 | v25.35,15.17 24,13.82 24,7.97 24.52,7.45 SV2.8
  Bottom 0.3: v50.35,40.22 58.6,40.22 58.7,40.32 58.7,40.27 v58.65,40.22
SCK  (via drill 0.35)
  Top 0.2: CC1110-DEBUG.6 v44.09,5.72 v44.1,5.72 41.85,3.47 33.05,3.47 32.3,2.72 28.6,2.72 27.44,1.57 21.25,1.57 20.04,2.78 SV2.12 | 25.55,22.22 25.55,20.92 26.9,19.57 v27.15,19.57
  Top 0.24: 25.51,21.81 CC1110.34 25.55,22.22
  Bottom 0.2: SV1.3 52.3,11.66 52.3,5.27 51.8,4.77 44.75,4.77 44.1,5.42 v44.1,5.72 | SV2.12 20.28,7.45 21.1,8.27 21.1,13.52 v27.15,19.57
SCK_BLE  (via drill 0.35)
  Top 0.2: U3.P0_5 47.16,34.22 v49.65,34.22 | v53.9,33.42 53.65,33.17 53.65,25.97 55.1,24.52 58.1,24.52 58.49,24.13 BLE113-DEBUG.6 58.6,22.58 58.6,19.22 58.65,19.17 58.65,14.62 57.92,13.89 SV1.4
  Bottom 0.2: v49.65,34.22 50.45,33.42 v53.9,33.42
SSN  (via drill 0.35)
  Top 0.2: SV1.1 53.99,17.02 46.45,17.07 44.09,14.76 v44.09,14.72 CC1110-DEBUG.5 | CC1110.35 26,21.07 26.6,20.47 v27.65,20.47 | v34.3,6.12 34.2,6.02 v27.4,6.02 | v23.3,3.27 22.58,3.99 SV2.10
  Bottom 0.2: v27.65,20.47 27.65,19.93 27.76,19.82 27.76,19.32 21.55,13.11 21.55,7.97 22.07,7.45 SV2.10 | v44.09,14.72 35.49,6.12 v34.3,6.12 | v27.4,6.02 26.55,5.17 26.55,4.87 24.96,3.27 v23.3,3.27
SSN_BLE  (via drill 0.35)
  Top 0.152: U3.P0_4 47.09,35.01
  Top 0.2: v43.35,33.17 45.21,35.03 U3.P0_4
  Top 0.3: U3.P0_4 50.69,35.03 v51.25,34.47 | v59.95,33.82 59.95,30.67 58.4,29.12 58.4,26.84 BLE113-DEBUG.5
  Bottom 0.2: v43.35,33.17 43.35,32.62 57.55,18.42 57.55,16.91 SV1.2
  Bottom 0.3: v51.25,34.47 59.3,34.47 v59.95,33.82
V+
  Top 0.406: VREG.3 32.25,40.62 32.55,40.92 | 32.55,40.92 PWR.COM | C14.1 35.42,38.64 35.15,38.92 34.2,38.92 VREG.1 34.15,40.42 33.65,40.92 32.55,40.92
VBAT
  Top 0.45: U1.P$3 9.46,30.46 C3.1
  Top 0.5: U1.P$3 9.66,31.77 11.8,31.77 13.3,33.27 13.3,39.77 13.35,39.72 JP1.2 15.46,39.77 20.8,39.77 22.8,41.77 30.3,41.77 30.93,42.39 PWR.NC
VDD  (via drill 0.33, 0.35)
  Top 0.24: CC1110.19 21.32,27.16 21.05,27.52 21.05,30.52 21.3,30.77 21.66,31.27 | CC1110.22 20.79,25.66 19.05,27.39 18.66,27.39 18.66,27.5 v18.68,27.52
  Top 0.26: CC1110.25 20.04,24.16 C8.1 | CC1110.26 20.69,23.66 20.3,22.77 20.12,22.45 C10.1 | C7.1 22.8,21.27 23.01,21.56 CC1110.29 CC1110.28
  Top 0.3: 21.66,31.27 C12.1 24.11,31.38 C11.1 30.25,31.57 | 30.25,31.57 31.8,31.57 | 36.45,31.57 31.8,31.57 | 36.45,31.57 37.45,32.57 37.95,32.57 | 37.95,32.57 39.63,32.57 U3.DVDD | L1.1 31.8,31.57 | BLE113-DEBUG.2 61.1,22.62 v62.7,22.62 62.7,7.92 61.6,6.82 61.05,6.82 60.7,6.47 49.1,6.47 47.48,8.09 CC1110-DEBUG.2 46.75,7.97 46.75,2.67 46.35,2.27 35.1,2.27 34.5,2.87 v33.3,2.87 | v48.8,28.92 48.7,29.02 45.65,29.02 | 45.65,29.02 37.2,29.02 36.45,29.77 36.45,31.57 | CC1110.2 C1.1 29.1,23.61 29.1,21.97 29.45,21.62 43,21.62 45.65,24.27 45.65,29.02 | CC1110.10 26.6,27.97 28.15,27.97 30.25,30.07 30.25,31.57 | U3.AVDD 39.63,39.77 38.05,39.77 37.95,39.67 37.95,32.57
  Top 0.4: C8.1 v18.6,21.62 | v18.6,21.62 19.3,20.92 19.3,19.29 20.8,17.79 20.8,17.77 21.85,17.77 22.65,18.57 C7.1 | v18.6,21.62 19.4,22.42 C10.1
  Top 0.406: L1.1 31.8,35.92 VREG.4 31.61,35.72 C4.1
  Top 0.5: 18.66,27.39 C13.1 | v22.23,29.57 C11.1
  Bottom 0.3: v62.7,22.62 56.4,28.92 v48.8,28.92 | v33.3,2.87 32.74,3.43 SV2.2
  Bottom 0.4: 18.8,27.39 v18.68,27.52 18.6,27.44 v18.6,21.62
  Bottom 0.5: v22.23,29.57 v18.68,27.52
VIN_USB
  Top 0.3: 3.81,35.89 R2.1
  Top 0.406: C2.1 9.97,35.45 arc90 9.46,34.95 U1.P$4
  Top 0.45: U1.P$4 7.95,35.98 X3.1 7.95,36.42 7.42,35.89 3.81,35.89
  Top 0.6: ALT.PWR.2 2.3,30.6 2.3,35.27 2.92,35.89 3.81,35.89

### Text on the board
tNames: Ant | RL Tester | SSN | SCK | P0_0 | P0_1 | P0_2 | P0_3 | P0_4 | P0_5 | P0_6 | GND | MOSI | MISO | MISO | MOSI | SCK | SSN | RESET | P1_7B | P1_6B | VDD